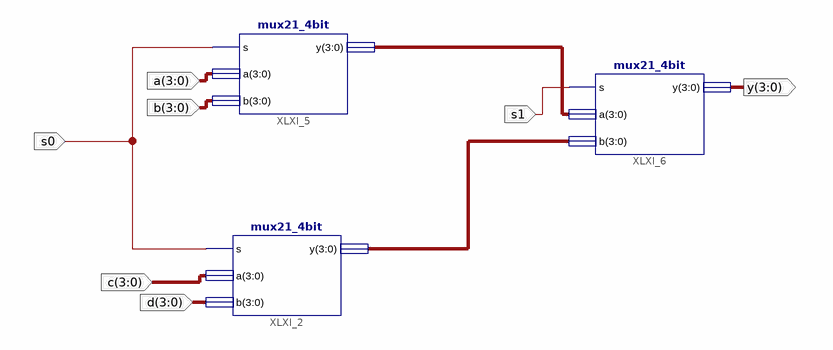
[diagram p0: schematic sheet 1]
// Xilinx ISE schematic mux41_4bit.sch (spartan3e) as structural Verilog: 3 symbols, 7 ports
module mux41_4bit (
  input  s0,
  input  s1,
  input  [3:0] c,
  input  [3:0] d,
  input  [3:0] a,
  input  [3:0] b,
  output [3:0] y
);

  wire [3:0] XLXN_9, XLXN_10;

  mux21_4bit XLXI_2 (.s(s0), .a(c), .b(d), .y(XLXN_10));
  mux21_4bit XLXI_5 (.s(s0), .a(a), .b(b), .y(XLXN_9));
  mux21_4bit XLXI_6 (.s(s1), .a(XLXN_9), .b(XLXN_10), .y(y));
endmodule
